# EAGLE design UpLiftDesk (EAGLE 7.2.0)
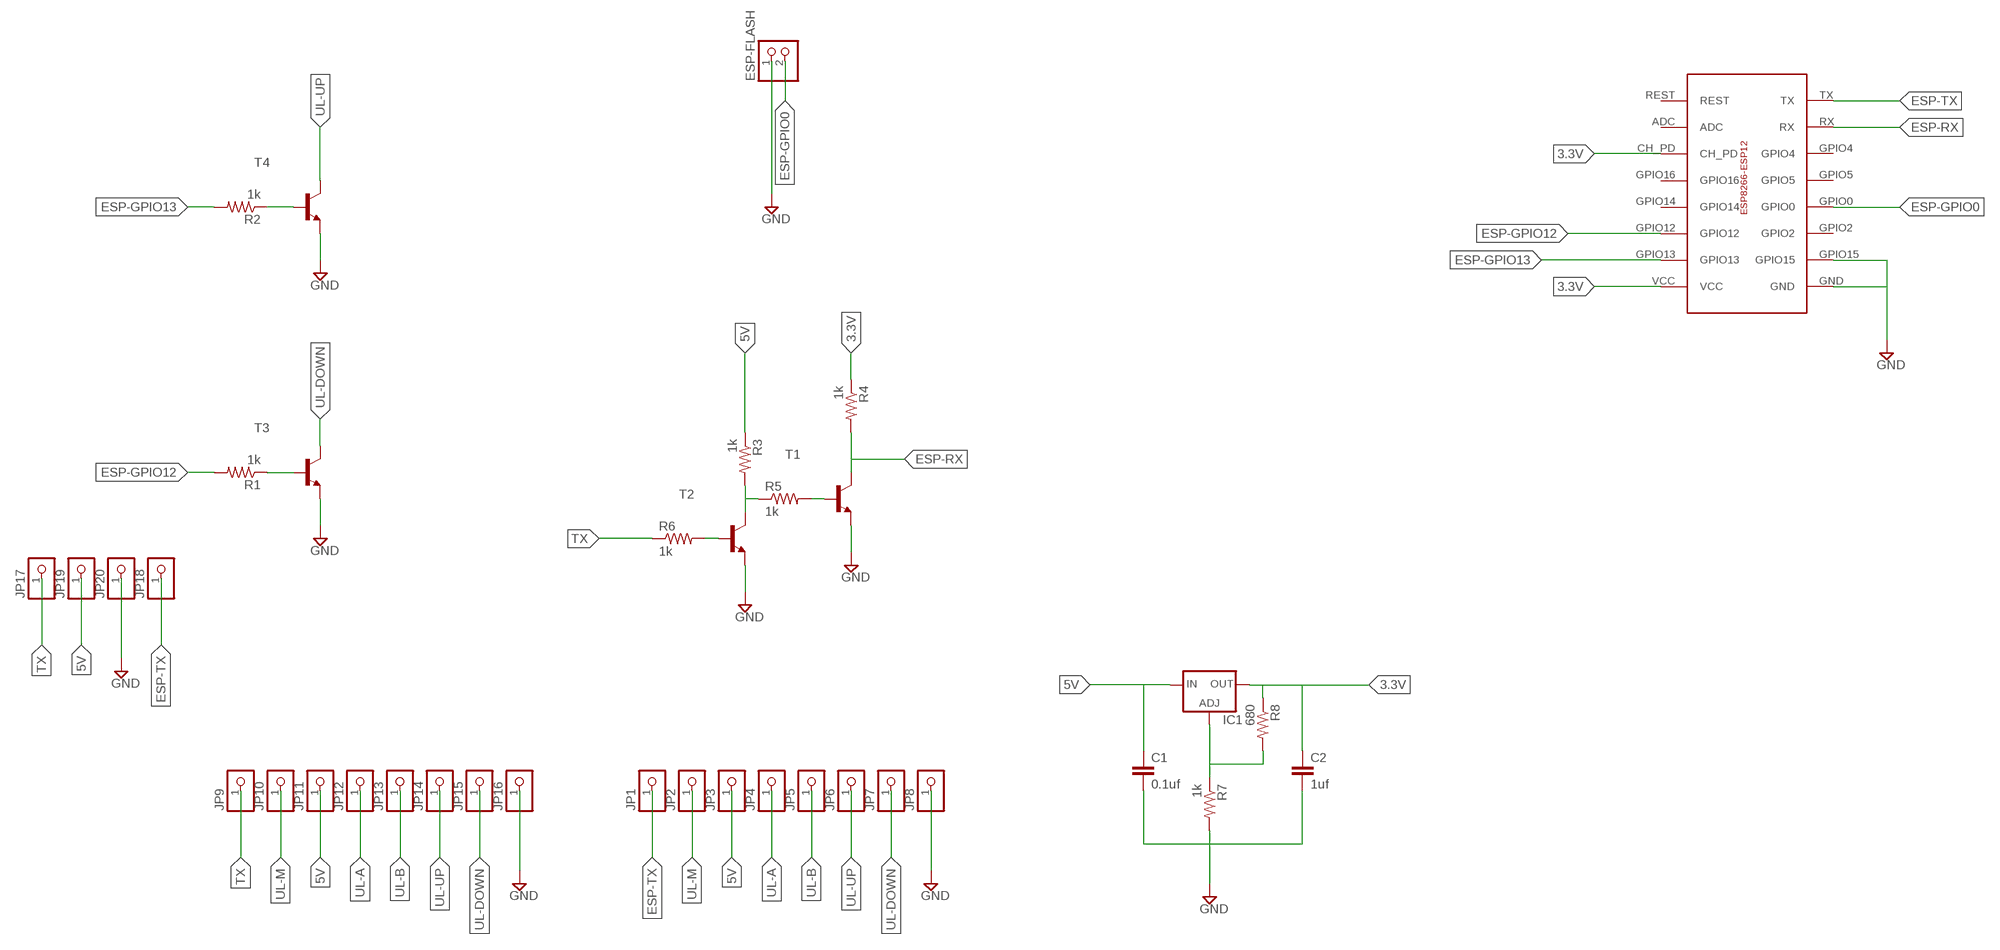
[diagram p0: schematic, sheet 1]

## Parts
C1  0.1uf  C2.5/2  [C2.5-2]
C2  1uf  C2.5/2  [C2.5-2]
ESP-FLASH  PINHD-1X2  [1X02]
IC1  LM317TS  [317TS]
JP1  PINHD-1X1  [1X01]
JP2  PINHD-1X1  [1X01]
JP3  PINHD-1X1  [1X01]
JP4  PINHD-1X1  [1X01]
JP5  PINHD-1X1  [1X01]
JP6  PINHD-1X1  [1X01]
JP7  PINHD-1X1  [1X01]
JP8  PINHD-1X1  [1X01]
JP9  PINHD-1X1  [1X01]
JP10  PINHD-1X1  [1X01]
JP11  PINHD-1X1  [1X01]
JP12  PINHD-1X1  [1X01]
JP13  PINHD-1X1  [1X01]
JP14  PINHD-1X1  [1X01]
JP15  PINHD-1X1  [1X01]
JP16  PINHD-1X1  [1X01]
JP17  PINHD-1X1  [1X01]
JP18  PINHD-1X1  [1X01]
JP19  PINHD-1X1  [1X01]
JP20  PINHD-1X1  [1X01]
R1  1k  R-US_0204/7  [0204/7]
R2  1k  R-US_0204/7  [0204/7]
R3  1k  R-US_0204/7  [0204/7]
R4  1k  R-US_0204/7  [0204/7]
R5  1k  R-US_0204/7  [0204/7]
R6  1k  R-US_0204/7  [0204/7]
R7  1k  R-US_0204/7  [0204/7]
R8  680  R-US_0204/7  [0204/7]
T1  -NPN-TO92-EBC  [TO92-EBC]
T2  -NPN-TO92-EBC  [TO92-EBC]
T3  -NPN-TO92-EBC  [TO92-EBC]
T4  -NPN-TO92-EBC  [TO92-EBC]
U$2  ESP-12-THROUGH  [ESP-12-THROUGH]

## Nets
3.3V: C2.1 IC1.2(OUT) R4.1 R8.1 U$2.CH_PD U$2.VCC
5V: C1.1 IC1.3(IN) JP3.1 JP11.1 JP19.1 R3.1
ESP-GPIO0: ESP-FLASH.2 U$2.GPIO0
ESP-GPIO12: R1.2 U$2.GPIO12
ESP-GPIO13: R2.2 U$2.GPIO13
ESP-RX: R4.2 T1.C U$2.RX
ESP-TX: JP1.1 JP18.1 U$2.TX
GND: C1.2 C2.2 ESP-FLASH.1 JP8.1 JP16.1 JP20.1 R7.2 T1.E T2.E T3.E T4.E U$2.GND U$2.GPIO15
N$1: R3.2 R5.1 T2.C
N$2: R6.2 T2.B
N$3: R1.1 T3.B
N$5: R2.1 T4.B
N$6: R5.2 T1.B
N$8: IC1.1(ADJ) R7.1 R8.2
TX: JP9.1 JP17.1 R6.1
UL-A: JP4.1 JP12.1
UL-B: JP5.1 JP13.1
UL-DOWN: JP7.1 JP15.1 T3.C
UL-M: JP2.1 JP10.1
UL-UP: JP6.1 JP14.1 T4.C
Unconnected: U$2.ADC U$2.GPIO2 U$2.GPIO4 U$2.GPIO5 U$2.GPIO14 U$2.GPIO16 U$2.REST

## Library data of the parts
C1 C2 = capacitor-wima:C: CAPACITOR naming: grid - package width
ESP-FLASH = pinhead:PINHD-1X2: PIN HEADER
IC1 = v-reg:LM317TS: VOLTAGE REGULATOR
JP1-JP20 = pinhead:PINHD-1X1: PIN HEADER
R1-R8 = resistor:R-US_: RESISTOR, American symbol
T1-T4 = transistor:*-NPN-: NPN Transistror BF959 corrected 2008.03.06
U$2 = ESP8266:ESP-12-THROUGH

## Board
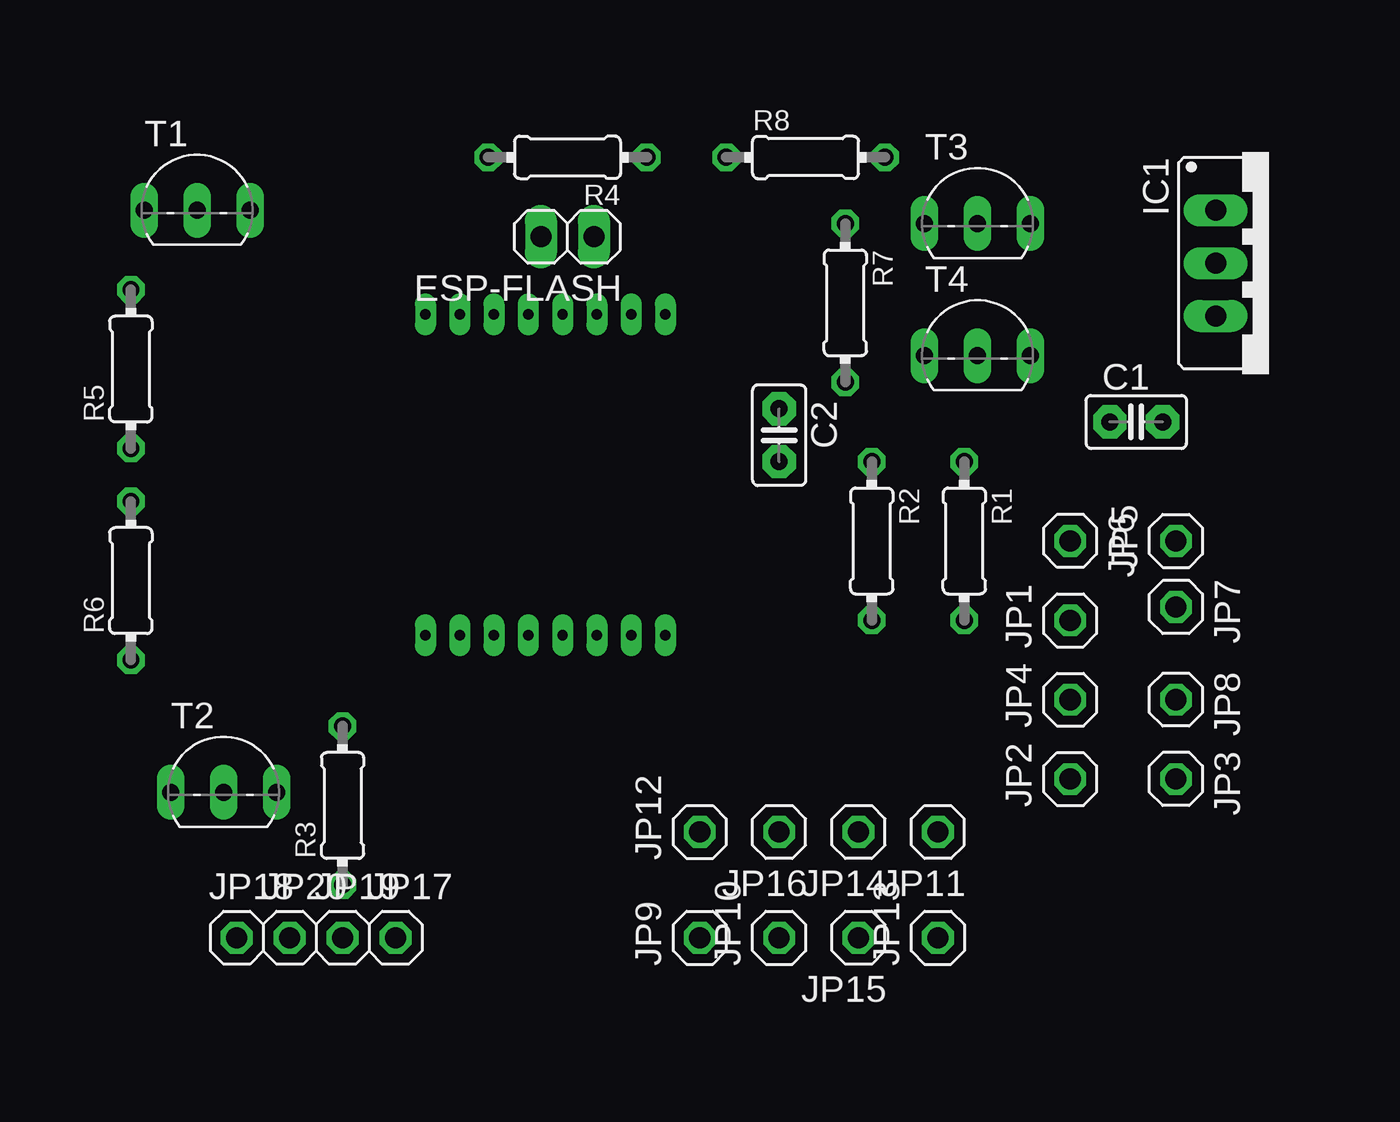
[diagram p1: board, top side]
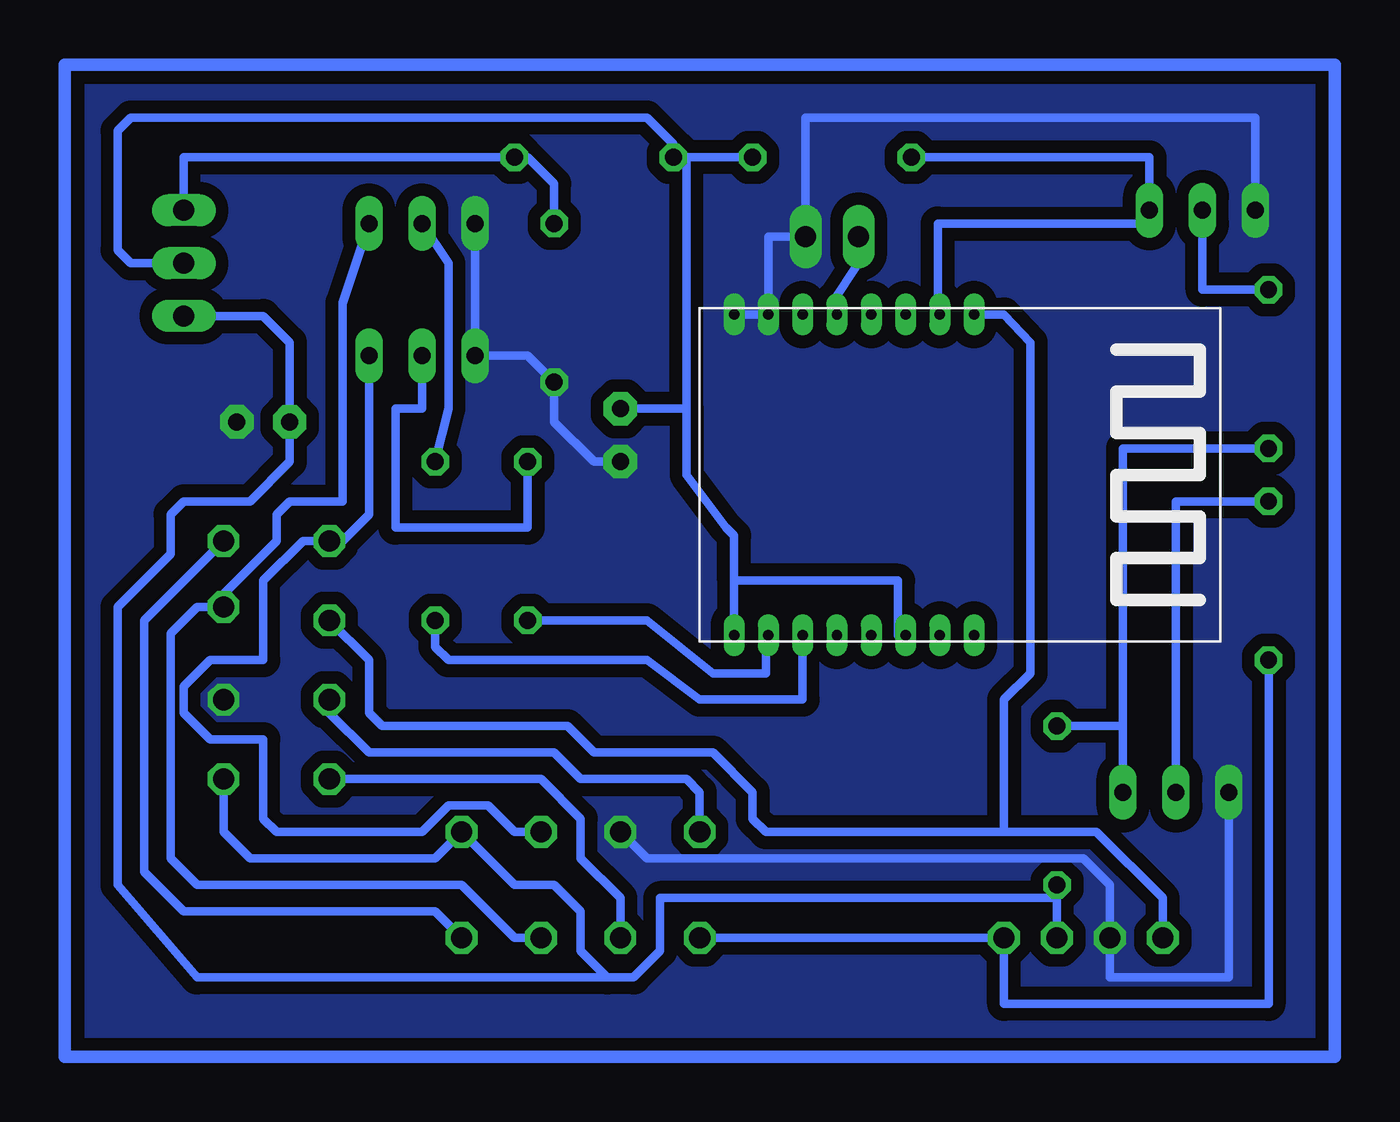
[diagram p2: board, bottom side, seen from below]

No outline drawn. Coordinates in mm, seen from the top.
Copper layers (1*16): Top 0.035mm / dielectric 1.5mm / Bottom 0.035mm
Design rules "default": minimum track width 10mil, minimum drill 24mil, track to track 8mil, track to pad 8mil, pad to pad 8mil, via to via 8mil, smd to smd 8mil, copper to edge 40mil, drill to drill 8mil, minimum pad ring 10mil, minimum via ring 8mil, stop-mask expansion 4mil, vias tented up to drill 0mil, thermal gap 10mil

### Footprints (pad centres in the part's own frame; a part is rotated, then mirrored left to right if it is on the bottom)
C2.5-2 = drill 0.813 pad 1.6 octagon: 1 -1.27,0; 2 1.27,0
1X02 = drill 1.016 long: 1 -1.27,0; 2 1.27,0
317TS = drill 1.016 long: 1 -2.54,-2.54; 2 0,-2.54; 3 2.54,-2.54
1X01 = drill 1.016 octagon: 1 0,0
0204/7 = drill 0.813 octagon: 1 -3.81,0; 2 3.81,0
TO92-EBC = drill 0.813 long: B 0,-1.27; C 2.54,-1.27; E -2.54,-1.27
ESP-12-THROUGH = drill 0.5 pad 0.813 long: ADC -11.525,7.7; CH_PD -9.878,7.7; GND -1.646,-7.7; GPIO0 -6.586,-7.7; GPIO2 -4.939,-7.7; GPIO4 -9.878,-7.7; GPIO5 -8.232,-7.7; GPIO12 -4.939,7.7; GPIO13 -3.293,7.7; GPIO14 -6.586,7.7; GPIO15 -3.293,-7.7; GPIO16 -8.232,7.7; REST -13.171,7.7; RX -11.525,-7.7; TX -13.171,-7.7; VCC -1.646,7.7

### Placement (x,y rotation side)
C1  76.83,31.11 0 top
C2  59.69,30.48 270 top
ESP-FLASH  49.53,40.01 180 top
IC1  83.19,38.73 270 top
JP1  73.66,21.59 90 top
JP2  73.66,13.97 90 top
JP3  78.74,13.97 270 top
JP4  73.66,17.78 90 top
JP5  78.74,25.4 90 top
JP6  73.66,25.4 270 top
JP7  78.74,22.23 270 top
JP8  78.74,17.78 270 top
JP9  55.88,6.35 90 top
JP10  59.69,6.35 90 top
JP11  67.31,11.43 180 top
JP12  55.88,11.43 90 top
JP13  67.31,6.35 90 top
JP14  63.5,11.43 180 top
JP15  63.5,6.35 180 top
JP16  59.69,11.43 180 top
JP17  41.27,6.35 0 top
JP18  33.66,6.35 0 top
JP19  38.73,6.35 0 top
JP20  36.2,6.35 0 top
R1  68.58,25.4 270 top
R2  64.14,25.4 270 top
R3  38.73,12.7 90 top
R4  49.53,43.81 180 top
R5  28.57,33.66 90 top
R6  28.57,23.5 90 top
R7  62.87,36.83 270 top
R8  60.96,43.81 0 top
T1  31.75,42.55 0 top
T2  33.02,14.61 0 top
T3  69.22,41.91 0 top
T4  69.22,35.56 0 top
U$2  55.88,28.57 180 bottom

### Tracks (layer width: path | path; a pad name or v marks a point on that pad's centre or on a via)
3.3V
  Bottom 0.406: R4.1 56.52,43.81 | 56.52,31.75 56.52,28.57 54.61,26.04 54.23,25.66 54.23,23.5 | U$2.CH_PD 46.35,20.88 46.35,23.5 54.23,23.5 | 54.23,23.5 U$2.VCC | C2.1 56.52,31.75 | 56.52,31.75 56.52,43.81 | 56.52,43.81 R8.1 57.15,44.45 58.42,45.72 83.19,45.72 83.82,45.09 83.82,39.37 83.19,38.73 IC1.2
5V
  Bottom 0.406: 60.33,4.45 61.59,5.71 61.59,7.62 62.87,8.89 64.77,8.89 JP11.1 68.58,10.16 77.47,10.16 78.74,11.43 JP3.1 | JP19.1 38.73,8.26 | 38.73,8.26 57.78,8.26 57.78,5.71 59.05,4.45 60.33,4.45 | 60.33,4.45 80.01,4.45 83.82,8.89 83.82,22.23 81.28,24.77 81.28,26.67 80.64,27.3 77.47,27.3 75.56,29.21 C1.1 75.56,34.92 76.83,36.2 IC1.3 | R3.1 38.73,8.26
ESP-GPIO0
  Bottom 0.406: ESP-FLASH.2 48.26,38.73 49.53,36.83 49.53,36.27 U$2.GPIO0
ESP-GPIO12
  Bottom 0.406: R1.2 68.58,20.32 67.94,19.68 58.42,19.68 55.88,17.78 50.94,17.78 U$2.GPIO12
ESP-GPIO13
  Bottom 0.406: U$2.GPIO13 52.7,20.88 52.7,19.05 55.24,19.05 58.42,21.59 R2.2
ESP-RX
  Bottom 0.406: U$2.RX 44.45,36.27 44.45,40.64 34.29,40.64 T1.C 34.29,43.81 R4.2
ESP-TX
  Bottom 0.406: JP18.1 33.66,8.26 36.83,11.43 41.27,11.43 | JP1.1 71.75,19.68 71.75,17.14 71.12,16.51 62.23,16.51 60.96,15.24 55.24,15.24 53.34,13.34 53.34,12.06 52.7,11.43 41.27,11.43 | U$2.TX 41.27,36.27 40.01,34.92 40.01,19.05 41.27,17.78 41.27,11.43
GND
  Bottom 0.406: JP16.1 58.42,10.16 37.47,10.16 36.2,8.89 JP20.1 36.2,4.45 30.48,4.45 T2.E | U$2.GND U$2.GPIO15 52.59,40.01 ESP-FLASH.1 50.8,45.72 29.21,45.72 T1.E | T3.E T4.E 64.14,34.29 R7.2 62.87,31.11 60.96,29.21 C2.2
  pour Bottom (isolate 0.61, no thermals): 26.04,47.62 85.72,47.62 85.72,1.27 26.04,1.27
N$1
  Bottom 0.406: R5.1 35.56,29.84 35.56,16.51 | T2.C 35.56,16.51 | 35.56,16.51 R3.2
N$2
  Bottom 0.406: R6.2 33.02,27.3 T2.B
N$3
  Bottom 0.406: R1.1 67.94,31.75 67.94,38.73 T3.B
N$4
  Bottom 0.61: 25.4,48.26 86.36,48.26 86.36,0.64 25.4,0.64 25.4,48.26
N$5
  Bottom 0.406: R2.1 64.14,26.04 70.48,26.04 70.48,31.75 69.22,31.75 T4.B
N$6
  Bottom 0.406: R5.2 31.75,37.47 T1.B
N$8
  Bottom 0.406: R7.1 62.87,42.55 64.14,43.81 R8.2 80.64,43.81 IC1.1
TX
  Bottom 0.406: JP9.1 JP17.1 41.27,3.17 28.57,3.17 R6.1
UL-A
  Bottom 0.406: JP4.1 73.66,17.14 71.75,15.24 62.87,15.24 61.59,13.97 56.52,13.97 55.88,13.34 JP12.1
UL-B
  Bottom 0.406: JP13.1 68.58,7.62 80.64,7.62 82.55,9.53 82.55,21.59 JP5.1
UL-DOWN
  Bottom 0.406: JP15.1 64.77,6.35 67.31,8.89 80.01,8.89 81.28,10.16 81.28,20.95 80.01,22.23 JP7.1 78.74,22.86 76.2,25.4 76.2,26.67 75.56,27.3 73.03,27.3 73.03,36.83 T3.C
UL-M
  Bottom 0.406: JP10.1 59.69,8.26 61.59,10.16 61.59,12.06 63.5,13.97 JP2.1
UL-UP
  Bottom 0.406: JP14.1 64.77,11.43 66.04,12.7 67.94,12.7 69.22,11.43 76.2,11.43 76.83,12.06 76.83,15.88 79.38,15.88 80.64,17.14 80.64,18.41 79.38,19.68 76.83,19.68 76.83,23.5 74.93,25.4 JP6.1 73.03,25.4 71.75,26.67 T4.C